# Altium schematic sheet Gate_Driver.SchDoc
size A4; SheetNumber: 6; SheetTotal: 13
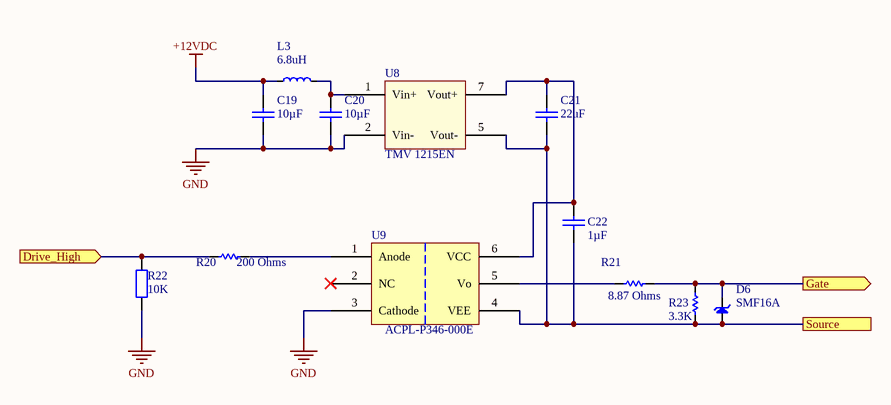
[diagram p0: Gate_Driver.SchDoc]

## Parts
C19  10µF  [0603C]
C20  10µF  [0603C]
C21  22uF  [0805c]
C22  1µF  [0603C]
D6  SMF16A  [SOD-123H]
L3  6.8uH  [1206R]
R20  200 Ohms  [0603R]
R21  8.87 Ohms  [0805R]
R22  10K  [RES 0603/1608]
R23  3.3K  [0603R]
U8  TMV 1215EN  [TMVXXXXEN]
U9  ACPL-P346-000E  [ACPL-P346-000E]

## Ports
Drive_High (in), Gate (out), Source

## Nets
+12VDC: C19.1 L3.1
GND: C19.2 C20.2 R22.1 U8.2(Vin-) U9.3(Cathode)
Drive_High: R20.1 R22.2 ; port Drive_High
Gate: D6.K R21.2 R23.2 ; port Gate
Source: C21.2 C22.2 D6.A R23.1 U8.5(Vout-) U9.4(VEE) ; port Source
NetC20_1: C20.1 L3.2 U8.1(Vin+)
NetC21_1: C21.1 C22.1 U8.7(Vout+) U9.6(VCC)
NetR20_2: R20.2 U9.1(Anode)
NetR21_1: R21.1 U9.5(Vo)

Not connected (* = marked no-connect by the designer): U9 2(NC)*

## Library data of the parts
C19 C20 = 1000-0107: CAP CER 10UF 16V X6S 0603; Manufacturer: Murata Electronics; Manufacturer Part Number: GRM188C81C106MA73D; id: 427111; inventory_price: 0.1975; x_Link_Description: Datasheet; x_max_temp: 105°C; x_min_temp: -55°C; x_Tolerance: ±20%; partnumber: 1000-0107; created_on: 9/04/2021 11:45:26 AM; parttype: Ceramic Capacitors; rohs: 1; updated_on: 24/08/2021 12:09:56 PM; x_Capacitance: 10µF; x_Link_URL: https://www.murata.com/-/media/webrenewal/support/library/catalog/products/capacitor/ceramiccapacitor/c02e.ashx?la=en-us&cvid=20210120024548000000; x_temp_coef: X6S; x_Vol: 16V
C21 = 1000-0047: CAP CER 2.2UF 25V X5R 0805; Manufacturer: Samsung Electro-Mechanics; Manufacturer Part Number: CL21A225KAFNNNG; id: 377963; inventory_price: 0.0384; x_Capacitance: 2.2µF; x_Link_Description: Datasheet; x_max_temp: 85°C; x_min_temp: -55°C; x_Tolerance: ±10%; partnumber: 1000-0047; created_on: 31/03/2020 1:35:31 PM; parttype: Ceramic Capacitors; rohs: 1; updated_on: 24/08/2021 12:09:55 PM; x_Link_URL: https://www.samsungsem.com/error500.html
C22 = 1000-0053: CAP CER 1UF 25V X7R 0603; Manufacturer: Samsung Electro-Mechanics; Manufacturer Part Number: CL10B105KA8NNNC; id: 402613; inventory_price: 0.1; x_current: Not Applicable; x_link_description: Datasheet; x_max_temp: 125°C; x_min_temp: -55°C; x_port_to_unleashed: No; x_Tolerance: ±10%; partnumber: 1000-0053; created_on: 5/08/2020 3:03:59 PM; parttype: Ceramic Capacitors; rohs: 1; updated_on: 3/02/2022 2:42:16 PM; x_Capacitance: 1 µF; x_inductance: Not Applicable; x_link_url: https://www.samsungsem.com/kr/support/product-search/mlcc/CL10B105KA8NNNC.jsp; x_power: Not Applicable; x_resistance: Not Applicable; x_temp_coef: X7R; x_vol: 25V
D6 = SMF16A: Zener Diode; manufacturer: Littelfuse Inc.; Maximun Temperature: 150; Minimum Temperature: -55; Voltage: 16V; inventory_price: 0.36; partnumber: SMF16A; Manufacturer Part Number: SMF16A; URL Datasheet: https://www.littelfuse.com/~/media/electronics/datasheets/tvs_diodes/littelfuse_tvs_diode_smf_datasheet.pdf.pdf; parttype: TVS - Diodes
L3 = 1002-0001: FIXED IND 6.8UH 380MA 170 MOHM; Manufacturer Part Number: LB3218T6R8M; manufacturer: Taiyo Yuden; id: 376135; inventory_price: 0.1447; x_current: pcbs@relectrify.com; x_Link_Description: Datasheet; x_Tolerance: ±20%; ComponentLink1Description: Datasheet; ComponentLink1URL: https://www.bourns.com/docs/Product-Datasheets/SRR1260.pdf; partnumber: 1002-0001; created_on: 4/03/2020 11:07:19 PM; parttype: Fixed Inductors; rohs: 1; updated_on: 10/08/2021 1:51:55 PM; x_Link_URL: https://ds.yuden.co.jp/TYCOMPAS/ut/detail?pn=LB3218T6R8M  &u=M
R20 = 1007-0188: RES 200 OHM 1% 1/8W 0603; Manufacturer: Stackpole Electronics Inc; Manufacturer Part Number: RNCP0603FTD200R; id: 474437; inventory_price: 0.1; x_Capacitance: Not Applicable; x_link_description: Datasheet; x_max_temp: 155°C; x_min_temp: -55°C; x_port_to_unleashed: No; x_power: 0.125W, 1/8W; x_temp_coef: ±100ppm/°C; partnumber: 1007-0188; created_on: 15/05/2022 12:28:10 PM; parttype: Chip Resistor - Surface Mount; rohs: 1; updated_on: 15/05/2022 12:28:19 PM; x_current: Not Applicable; x_inductance: Not Applicable; x_link_url: https://www.seielect.com/catalog/sei-rncp.pdf; x_resistance: 200 Ohms; x_Tolerance: ±1%; x_vol: Not Applicable
R21 = 1007-0189: RES 8.87 OHM 1% 1/8W 0805; Manufacturer: Stackpole Electronics Inc; Manufacturer Part Number: RMCF0805FT8R87; id: 474438; inventory_price: 0.1; x_Capacitance: Not Applicable; x_link_description: Datasheet; x_max_temp: 155°C; x_min_temp: -55°C; x_port_to_unleashed: No; x_power: 0.125W, 1/8W; x_temp_coef: ±200ppm/°C; partnumber: 1007-0189; created_on: 15/05/2022 12:44:33 PM; parttype: Chip Resistor - Surface Mount; rohs: 1; updated_on: 15/05/2022 12:44:42 PM; x_current: Not Applicable; x_inductance: Not Applicable; x_link_url: https://www.seielect.com/catalog/sei-rmcf_rmcp.pdf; x_resistance: 8.87 Ohms; x_Tolerance: ±1%; x_vol: Not Applicable
R22 = RC0603FR-0710KL: RES SMD 10K OHM 1% 1/10W 0603; Manufacturer: Yageo; Package Imperial: 0603; Package Metric: 1608; Temperature Coefficient: ±100ppm/°C; Power (Watts): 0.1W, 1/10W; Part Number: RC0603FR-0710KL; Value: 10K; Tolerance: ±1%; Digi-Key Part Number: 311-10.0KHRCT-ND
R23 = 1007-0148: RES SMD 3.3K OHM 1% 1/10W 0603; Manufacturer: Ralec Electronic Corporation; Manufacturer Part Number: RTT033301FTP; id: 437722; inventory_price: 0.00535; x_link_description: Datasheet; x_max_temp: 155°C; x_min_temp: -55°C; partnumber: 1007-0148; created_on: 2/09/2021 1:57:43 PM; parttype: Chip Resistor - Surface Mount; rohs: 1; updated_on: 2/09/2021 1:57:50 PM; x_link_url: https://www.yageo.com/upload/media/product/productsearch/datasheet/rchip/PYu-RC_Group_51_RoHS_L_11.pdf; x_power: 1/10W; x_Tolerance: ±1%
U8 = PDM-S: DC DC CONVERTER 15V 1W; Manufacturer: Traco Power; ComponentLink1Description: Datasheet; Mount: TH; Supplier 1: Digi-Key; ComponentLink1URL: https://www.tracopower.com/products/tmv-en.pdf; Manufacturer Part Number: TMV 1215EN
U9 = 1107-0007: OPTOISO 3.75KV 1CH GATE DRVR 6SO; manufacturer: Broadcom Limited; id: 474436; inventory_price: 5; x_Capacitance: Not Applicable; x_link_description: Datasheet; x_max_temp: 105°C; x_min_temp: -40°C; x_port_to_unleashed: No; partnumber: 1107-0007; Manufacturer Part Number: ACPL-P346-000E; created_on: 15/05/2022 12:12:55 PM; parttype: Isolators - Gate Drivers; rohs: 1; updated_on: 15/05/2022 12:13:04 PM; x_current: Not Applicable; x_inductance: Not Applicable; x_link_url: https://docs.broadcom.com/docs/AV02-4078EN; x_power: Not Applicable; x_resistance: Not Applicable; x_temp_coef: Not Applicable; x_Tolerance: Not Applicable; x_vol: Not Applicable